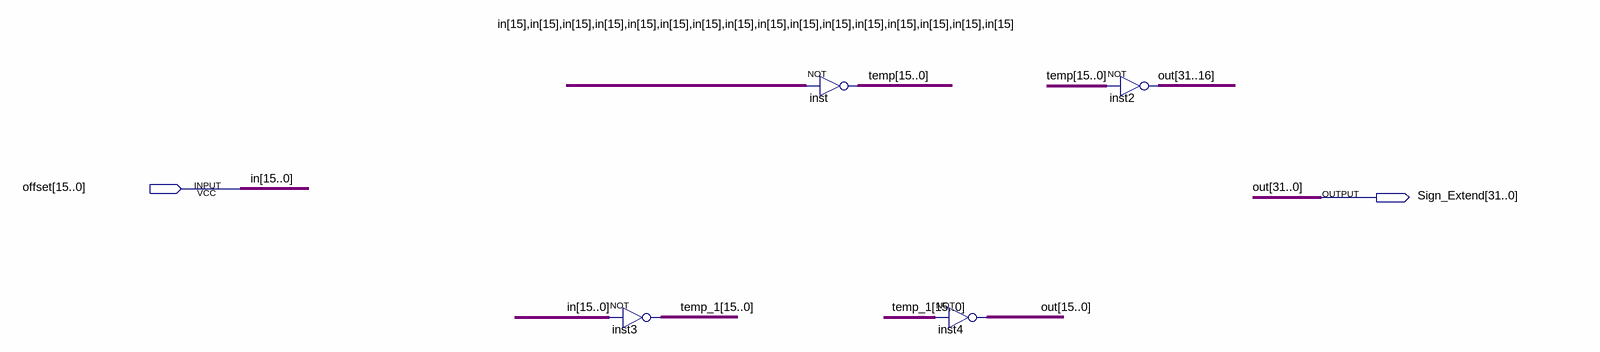
[diagram p0: schematic sheet]
// Quartus schematic Sign_Extend.bdf as structural Verilog: 4 symbols, 2 pins
module Sign_Extend (
  input  [15:0] offset,
  output [31:0] Sign_Extend
);

  wire [15:0] temp, temp_1;

  assign temp_1 = ~offset;  // NOT inst3, 16 bits wide
  assign temp = ~{16{offset[15]}};  // NOT inst, 16 bits wide
  assign Sign_Extend[15:0] = ~temp_1;  // NOT inst4, 16 bits wide
  assign Sign_Extend[31:16] = ~temp;  // NOT inst2, 16 bits wide

  // Other names for the same wires on the sheet: in[15:0] = offset; out[31:0] = Sign_Extend
endmodule
